# EasyEDA Pro project QuadPower.eprj

# Schematic Schematic1
Board Name: Board1; Create Date: 2025-01-30; Page Name: P1; Project Name: QuadPower; Schematic Name: Schematic1; Update Date: 2025-02-10; Company: SWimplify.co; Page Size: A4; Version: V1.0
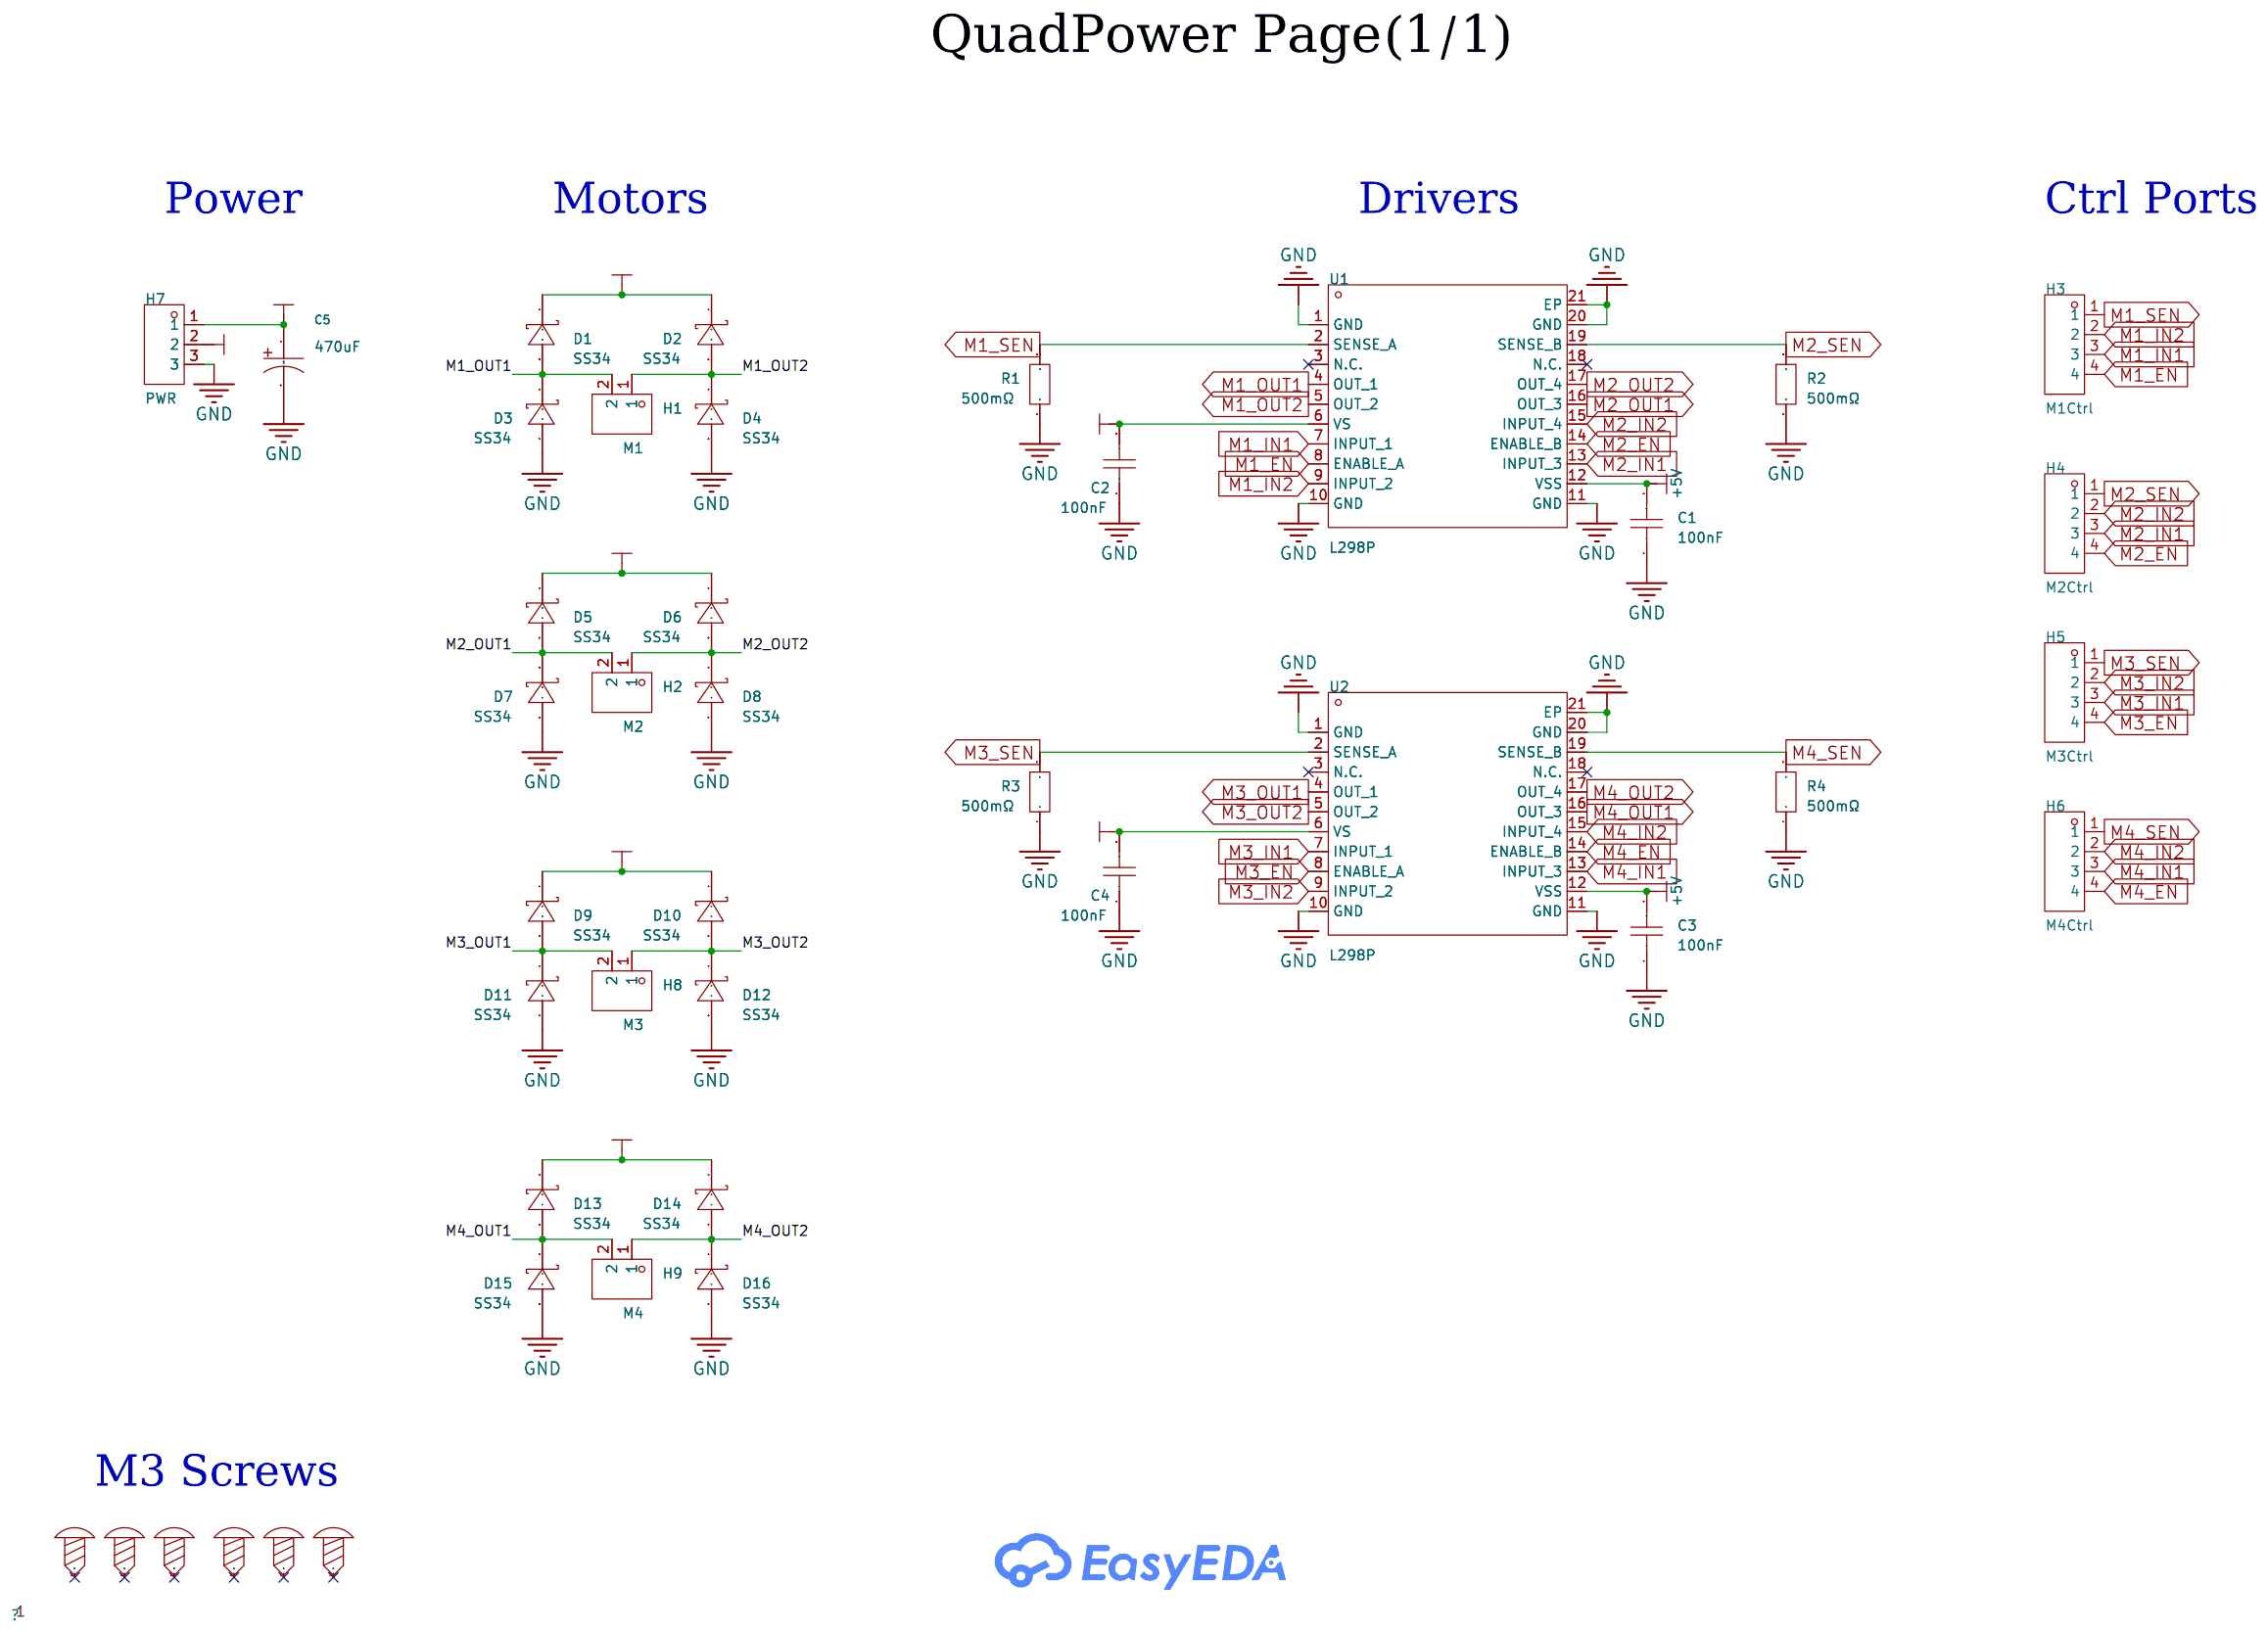
[diagram p0: schematic sheet]

## Parts
C1  100nF  [C0603]
C2  100nF  [C0603]
C3  100nF  [C0603]
C4  100nF  [C0603]
C5  470uF  [CAP-SMD_BD12.5-L13.0-W13.0-LS14.0-FD]
D1  SS34  [SMA_L4.3-W2.6-LS5.2-RD]
D2  SS34  [SMA_L4.3-W2.6-LS5.2-RD]
D3  SS34  [SMA_L4.3-W2.6-LS5.2-RD]
D4  SS34  [SMA_L4.3-W2.6-LS5.2-RD]
D5  SS34  [SMA_L4.3-W2.6-LS5.2-RD]
D6  SS34  [SMA_L4.3-W2.6-LS5.2-RD]
D7  SS34  [SMA_L4.3-W2.6-LS5.2-RD]
D8  SS34  [SMA_L4.3-W2.6-LS5.2-RD]
D9  SS34  [SMA_L4.3-W2.6-LS5.2-RD]
D10  SS34  [SMA_L4.3-W2.6-LS5.2-RD]
D11  SS34  [SMA_L4.3-W2.6-LS5.2-RD]
D12  SS34  [SMA_L4.3-W2.6-LS5.2-RD]
D13  SS34  [SMA_L4.3-W2.6-LS5.2-RD]
D14  SS34  [SMA_L4.3-W2.6-LS5.2-RD]
D15  SS34  [SMA_L4.3-W2.6-LS5.2-RD]
D16  SS34  [SMA_L4.3-W2.6-LS5.2-RD]
H1  M1  [CONN-TH_2P-P3.81_L7.4-W7.6]
H2  M2  [CONN-TH_2P-P3.81_L7.4-W7.6]
H3  M1Ctrl  [CONN-TH_DB125-2.54-4P-GN]
H4  M2Ctrl  [CONN-TH_DB125-2.54-4P-GN]
H5  M3Ctrl  [CONN-TH_DB125-2.54-4P-GN]
H6  M4Ctrl  [CONN-TH_DB125-2.54-4P-GN]
H7  PWR  [CONN-TH_3P-P3.81_L7.4-W11.4]
H8  M3  [CONN-TH_2P-P3.81_L7.4-W7.6]
H9  M4  [CONN-TH_2P-P3.81_L7.4-W7.6]
R1  500mΩ  [R1206]
R2  500mΩ  [R1206]
R3  500mΩ  [R1206]
R4  500mΩ  [R1206]
SCREW1  -  [Screw-Hole-M3]
SCREW2  -  [Screw-Hole-M3]
SCREW3  -  [Screw-Hole-M3]
SCREW4  -  [Screw-Hole-M3]
SCREW5  -  [Screw-Hole-M3]
SCREW6  -  [Screw-Hole-M3]
U1  L298P  [POWERSO20_L15.9-W11.0-P1.27-LS14.2-BL-EP]
U2  L298P  [POWERSO20_L15.9-W11.0-P1.27-LS14.2-BL-EP]

## Library data of the parts
C1-C4 = CGA0603X7R104K500JT: LCSC Part Name: 100nF ±10% 50V; Supplier Part: C6119867; Manufacturer: HRE(芯声); Supplier Footprint: 0603; JLCPCB Part Class: Extended Part; Supplier: LCSC; Tolerance: ±10%; Voltage Rated: 50V
C5 = RVT470UF50V34RV0133: Capacitance: Tolerance:±20% Tolerance:±20% Rated Voltage: Ripple Current:50mA@120Hz Equivalent Series Resistance(ESR):- φD: L: Lifetime @ Temp:2000hrs@105℃ Operating Temperature:-55℃~+105℃ Operating Temperature:-55℃~+105℃; LCSC Part Name: 470uF ±20% 50V; Supplier Part: C2837182; Manufacturer: KNSCHA(科尼盛); Supplier Footprint: SMD,D12.5xL13.5mm; JLCPCB Part Class: Extended Part; Datasheet: https://atta.szlcsc.com/upload/public/pdf/source/20210603/C2837182_E1DEB959C7A33C0F917E27B2DE8CCF98.pdf; Supplier: LCSC; Tolerance: ±20%; Ripple Current: 50mA@120Hz; Lifetime @ Temp: 2000hrs@105℃; Operating Temperature: -55℃~+105℃
D1-D16 = SS34_C8678: LCSC Part Name: 电压:40V 电流:3A; Supplier Part: C8678; Manufacturer: MDD(辰达半导体); Supplier Footprint: SMA(DO-214AC); JLCPCB Part Class: Basic Part; Datasheet: https://atta.szlcsc.com/upload/public/pdf/source/20240710/2118BB86FDDB2E0B294389AC1F3F65C8.pdf; Supplier: LCSC; Diode Configuration: Independent Type; Forward Voltage (Vf@If): 550mV@3A; Reverse Voltage (Vr): 40V; Rectified Current: 3A; Reverse Leakage Current (Ir): 500uA@40V
H1 H2 H8 H9 = DB125-3.81-2P-GN-S: LCSC Part Name: 3.81mm 1x2P 排数:1 每排P数:2 直插; Supplier Part: C395878; Manufacturer: DORABO(地博电气); Supplier Footprint: 插件,P=3.81mm; JLCPCB Part Class: Extended Part; Datasheet: https://atta.szlcsc.com/upload/public/pdf/source/20220823/CB89165D0F406880B925A92BEEA3FB50.pdf; Supplier: LCSC; Structure: 1x2P; Pitch: 3.81mm; Color: Green; Mounting Style: Straight; Current Rating (Max): 10A; Voltage Rating (Max): 300V; Number of Pins: 2P; Number of Rows: 1; Wire Gauge - AWG: 16~26; Wire Gauge - mm2: 0.5~1; Number of PINs Per Row: 2; Operating Temperature Range: -40℃~+105℃
H3-H6 = DB125-2.54-4P-GN-S: LCSC Part Name: 2.54mm 1x4P 排数:1 每排P数:4 直插; Supplier Part: C918122; Manufacturer: DORABO(地博电气); Supplier Footprint: 插件,P=2.54mm; JLCPCB Part Class: Extended Part; Datasheet: https://atta.szlcsc.com/upload/public/pdf/source/20230106/BCD3A0BE1EB95DC3E813F1745F022035.pdf; Supplier: LCSC; Structure: 1x4P; Pitch: 2.54mm; Color: Green; Mounting Style: Straight; Current Rating (Max): 8A; Voltage Rating (Max): 130V; Number of Pins: 4P; Number of Rows: 1; Wire Gauge - AWG: 18~26; Wire Gauge - mm2: 0.5~1; Number of PINs Per Row: 4; Operating Temperature Range: -40℃~+105℃
H7 = DB125-3.81-3P-GN-S: LCSC Part Name: 3.81mm 1x3P 排数:1 每排P数:3 直插; Supplier Part: C395879; Manufacturer: DORABO(地博电气); Supplier Footprint: 插件,P=3.81mm; JLCPCB Part Class: Extended Part; Datasheet: https://atta.szlcsc.com/upload/public/pdf/source/20220823/CB89165D0F406880B925A92BEEA3FB50.pdf; Supplier: LCSC; Structure: 1x3P; Pitch: 3.81mm; Color: Green; Mounting Style: Straight; Current Rating (Max): 10A; Voltage Rating (Max): 300V; Number of Pins: 3P; Number of Rows: 1; Wire Gauge - AWG: 16~26; Wire Gauge - mm2: 0.5~1; Number of PINs Per Row: 3; Operating Temperature Range: -40℃~+105℃
R1-R4 = HoYH1206-1W-500mR-1%: LCSC Part Name: 500mΩ ±1% 1W; Supplier Part: C601092; Manufacturer: Milliohm(毫欧); Supplier Footprint: 1206; JLCPCB Part Class: Extended Part; Datasheet: https://atta.szlcsc.com/upload/public/pdf/source/20200610/C601092_B551186B1E4AC109114EB92CE1D3D28D.pdf; Supplier: LCSC; Type: Current Sensing Resistors; Tolerance: ±1%; Temperature Coefficient: ±100ppm/℃; Mounting Sytle: Patch
SCREW1-SCREW6 = Screw-Hole-M3: Supplier Footprint: 插件; Check: false
U1 U2 = L298P: LCSC Part Name: 7V电机驱动芯片; Supplier Part: C85595; Manufacturer: ST(意法半导体); Supplier Footprint: PowerSO-20; JLCPCB Part Class: Extended Part; Datasheet: https://atta.szlcsc.com/upload/public/pdf/source/20181012/C111210_C12A10AEDADDE80938E7DEEDD1F73B12.pdf; Supplier: LCSC

## Nets
+5V: C1.2 C3.2 H7.2 U1.12(VSS) U2.12(VSS)
GND: C1.1 C2.1 C3.1 C4.1 C5.2 D3.2(A) D4.2(A) D7.2(A) D8.2(A) D11.2(A) D12.2(A) D15.2(A) D16.2(A) H7.3 R1.1 R2.1 R3.1 R4.1 U1.1(GND) U1.10(GND) U1.11(GND) U1.20(GND) U1.21(EP) U2.1(GND) U2.10(GND) U2.11(GND) U2.20(GND) U2.21(EP)
M1_EN: H3.4 U1.8(ENABLE A)
M1_IN1: H3.3 U1.7(INPUT 1)
M1_IN2: H3.2 U1.9(INPUT 2)
M1_OUT1: D1.2(A) D3.1(K) H1.2 U1.4(OUT 1)
M1_OUT2: D2.2(A) D4.1(K) H1.1 U1.5(OUT 2)
M1_SEN: H3.1 R1.2 U1.2(SENSE A)
M2_EN: H4.4 U1.14(ENABLE B)
M2_IN1: H4.3 U1.13(INPUT 3)
M2_IN2: H4.2 U1.15(INPUT 4)
M2_OUT1: D5.2(A) D7.1(K) H2.2 U1.16(OUT 3)
M2_OUT2: D6.2(A) D8.1(K) H2.1 U1.17(OUT 4)
M2_SEN: H4.1 R2.2 U1.19(SENSE B)
M3_EN: H5.4 U2.8(ENABLE A)
M3_IN1: H5.3 U2.7(INPUT 1)
M3_IN2: H5.2 U2.9(INPUT 2)
M3_OUT1: D9.2(A) D11.1(K) H8.2 U2.4(OUT 1)
M3_OUT2: D10.2(A) D12.1(K) H8.1 U2.5(OUT 2)
M3_SEN: H5.1 R3.2 U2.2(SENSE A)
M4_EN: H6.4 U2.14(ENABLE B)
M4_IN1: H6.3 U2.13(INPUT 3)
M4_IN2: H6.2 U2.15(INPUT 4)
M4_OUT1: D13.2(A) D15.1(K) H9.2 U2.16(OUT 3)
M4_OUT2: D14.2(A) D16.1(K) H9.1 U2.17(OUT 4)
M4_SEN: H6.1 R4.2 U2.19(SENSE B)
VS: C2.2 C4.2 C5.1 D1.1(K) D2.1(K) D5.1(K) D6.1(K) D9.1(K) D10.1(K) D13.1(K) D14.1(K) H7.1 U1.6(VS) U2.6(VS)

Not connected (* = marked no-connect by the designer): SCREW1 1*; SCREW2 1*; SCREW3 1*; SCREW4 1*; SCREW5 1*; SCREW6 1*; U1 3(N.C.)* 18(N.C.)*; U2 3(N.C.)* 18(N.C.)*

## Notes on the sheet
- QuadPower Page(1/1)
- Power
- Motors
- Drivers
- Ctrl Ports
- M3 Screws

# Board PCB1
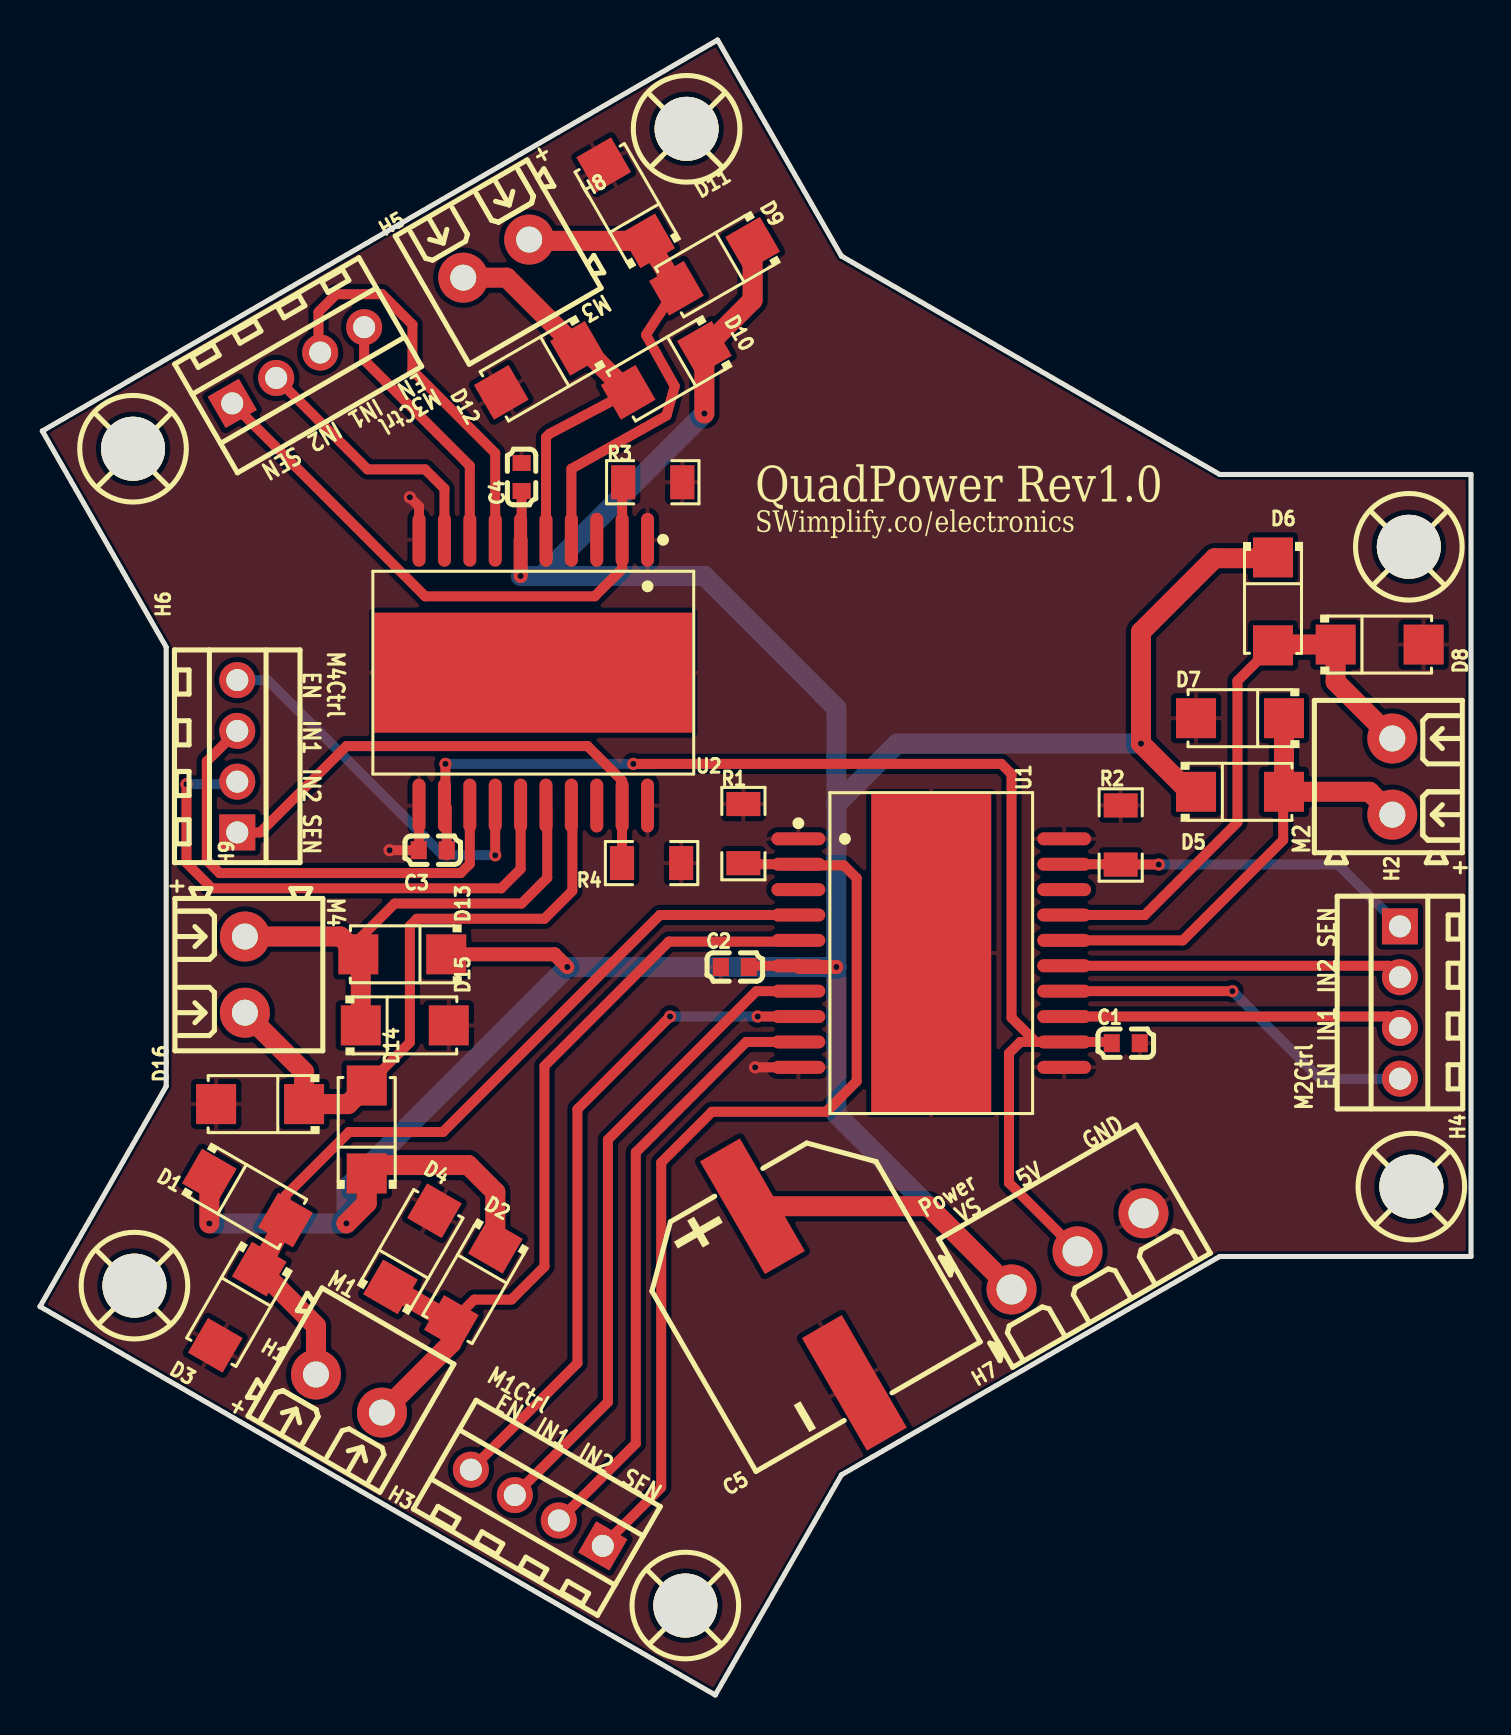
[diagram p1: board, top side]
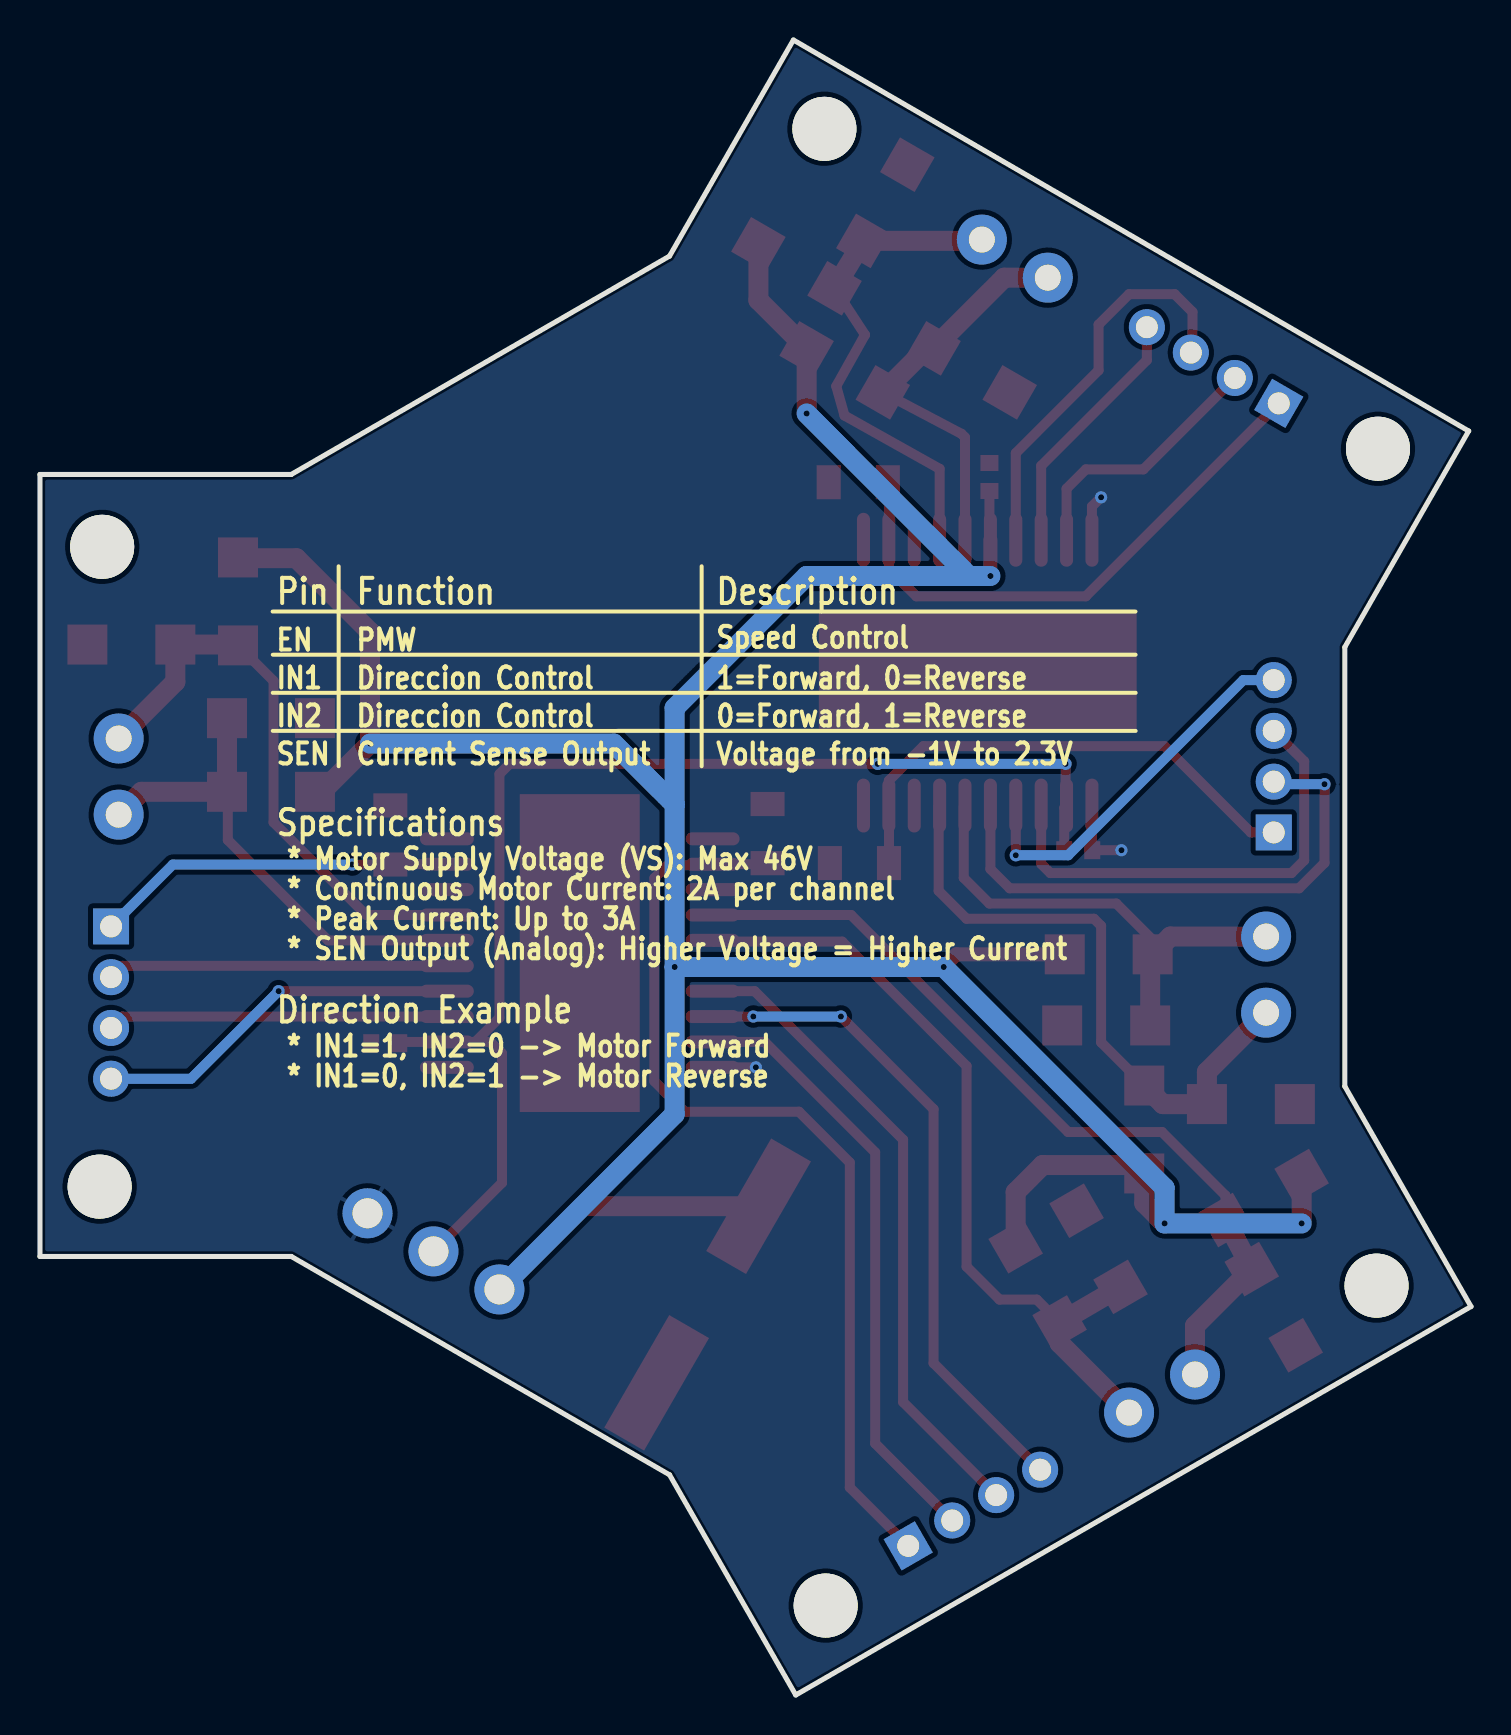
[diagram p2: board, bottom side, seen from below]

Outline 71.59 x 82.79 mm; copper layers: Top Layer, Bottom Layer. Coordinates in mm from the lower left corner of the outline.
Outline path: 0,19.43 6.31,30.45 6.31,52.42 0.12,63.23 33.9,82.79 40.1,71.98 59.02,61.05 71.59,61.05 71.59,21.94 59.02,21.94 40.1,11.02 33.78,0 0,19.43
Stack: Top Layer 0.035mm / Dielectric1 1.51mm FR4 er 4.5 / Bottom Layer 0.035mm

## Design rules (mm)
template: Custom Config
spacing copperThickness1oz (default): track to track 0.102, other pairs 0.152 to 0.3
spacing copperThickness2oz: track to track 0.203, other pairs 0.152 to 0.3
track width copperThickness1oz (default): min 0.127, default 0.254, max 2.54
track width copperThickness2oz: min 0.203, default 0.254, max 2.54
differential pair differentialPair (default): width min 0.127, default 0.254, max 2.54; gap min 0.152, default 0.152
via viaSize (default): diameter min 0.5, default 0.61, max 10; hole min 0.3, default 0.305, max 6.3
net GND uses copperRegion2

## Placement (name value [footprint] x y rotation side)
C1  100nF  [C0603]  54.32 32.61 180 top
C2  100nF  [C0603]  34.76 36.42 0 top
C3  100nF  [C0603]  19.65 42.26 0 top
C4  100nF  [C0603]  24.09 60.93 270 top
C5  470uF  [CAP-SMD_BD12.5-L13.0-W13.0-LS14.0-FD]  38.19 20.03 300 top
D1  SS34  [SMA_L4.3-W2.6-LS5.2-RD]  10.38 24.86 330 top
D2  SS34  [SMA_L4.3-W2.6-LS5.2-RD]  21.68 20.54 240 top
D3  SS34  [SMA_L4.3-W2.6-LS5.2-RD]  9.87 19.4 240 top
D4  SS34  [SMA_L4.3-W2.6-LS5.2-RD]  18.63 22.32 60 top
D5  SS34  [SMA_L4.3-W2.6-LS5.2-RD]  60.04 45.18 0 top
D6  SS34  [SMA_L4.3-W2.6-LS5.2-RD]  61.69 54.7 270 top
D7  SS34  [SMA_L4.3-W2.6-LS5.2-RD]  60.04 48.86 180 top
D8  SS34  [SMA_L4.3-W2.6-LS5.2-RD]  67.02 52.55 0 top
D9  SS34  [SMA_L4.3-W2.6-LS5.2-RD]  33.75 71.47 210 top
D10  SS34  [SMA_L4.3-W2.6-LS5.2-RD]  31.33 66.26 210 top
D11  SS34  [SMA_L4.3-W2.6-LS5.2-RD]  29.3 74.64 120 top
D12  SS34  [SMA_L4.3-W2.6-LS5.2-RD]  24.98 66.26 210 top
D13  SS34  [SMA_L4.3-W2.6-LS5.2-RD]  18.13 37.05 180 top
D14  SS34  [SMA_L4.3-W2.6-LS5.2-RD]  16.35 28.29 90 top
D15  SS34  [SMA_L4.3-W2.6-LS5.2-RD]  18.25 33.5 0 top
D16  SS34  [SMA_L4.3-W2.6-LS5.2-RD]  11.01 29.56 180 top
H1  M1  [CONN-TH_2P-P3.81_L7.4-W7.6]  15.46 15.08 150 top
H2  M2  [CONN-TH_2P-P3.81_L7.4-W7.6]  67.66 45.94 270 top
H3  M1Ctrl  [CONN-TH_DB125-2.54-4P-GN]  24.86 9.37 150 top
H4  M2Ctrl  [CONN-TH_DB125-2.54-4P-GN]  68.04 34.64 270 top
H5  M3Ctrl  [CONN-TH_DB125-2.54-4P-GN]  12.92 66.52 30 top
H6  M4Ctrl  [CONN-TH_DB125-2.54-4P-GN]  9.87 46.96 90 top
H7  PWR  [CONN-TH_3P-P3.81_L7.4-W11.4]  51.91 22.19 30 top
H8  M3  [CONN-TH_2P-P3.81_L7.4-W7.6]  22.82 71.85 30 top
H9  M4  [CONN-TH_2P-P3.81_L7.4-W7.6]  10.25 36.03 90 top
NOREF  -  [Screw-Hole-M3]  68.67 25.37 0 top
NOREF#2  -  [Screw-Hole-M3]  32.35 4.41 0 top
NOREF#3  -  [Screw-Hole-M3]  4.79 20.41 0 top
NOREF#4  -  [Screw-Hole-M3]  68.54 57.37 0 top
NOREF#5  -  [Screw-Hole-M3]  32.41 78.28 0 top
NOREF#6  -  [Screw-Hole-M3]  4.72 62.28 0 top
R1  500mΩ  [R1206]  35.19 43.09 270 top
R2  500mΩ  [R1206]  54.07 43.02 270 top
R3  500mΩ  [R1206]  30.66 60.66 180 top
R4  500mΩ  [R1206]  30.6 41.61 180 top
U1  L298P  [POWERSO20_L15.9-W11.0-P1.27-LS14.2-BL-EP]  44.59 37.11 270 top
U2  L298P  [POWERSO20_L15.9-W11.0-P1.27-LS14.2-BL-EP]  24.68 51.14 180 top

## Footprints (pads in the part's own frame, mm; a bottom-side part is the same pattern mirrored in y, then rotated)
C0603
  rect 0.8x0.9 smd: 1(-0.7,0) 2(0.7,0)
CAP-SMD_BD12.5-L13.0-W13.0-LS14.0-FD
  rect 6.5x2.3 smd: 1(-5.1,0) 2(5.1,0)
CONN-TH_2P-P3.81_L7.4-W7.6
  round 2.5 hole 1.3: 1(-1.905,0) 2(1.905,0)
CONN-TH_3P-P3.81_L7.4-W11.4
  round 2.5 hole 1.5: 1(-3.81,0) 2(0,0) 3(3.81,0)
CONN-TH_DB125-2.54-4P-GN
  rect 1.8x1.8 hole 1.1: 1(-3.81,0)
  round 1.8 hole 1.1: 2(-1.27,0) 3(1.27,0) 4(3.81,0)
POWERSO20_L15.9-W11.0-P1.27-LS14.2-BL-EP
  oval 0.651x2.696 smd: 1(-5.715,-6.647) 2(-4.445,-6.647) 3(-3.175,-6.647) 4(-1.905,-6.647) 5(-0.635,-6.647) 6(0.635,-6.647) 7(1.905,-6.647) 8(3.175,-6.647) 9(4.445,-6.647) 10(5.715,-6.647) 11(5.715,6.647) 12(4.445,6.647) 13(3.175,6.647) 14(1.905,6.647) 15(0.635,6.647) 16(-0.635,6.647) 17(-1.905,6.647) 18(-3.175,6.647) 19(-4.445,6.647) 20(-5.715,6.647)
  rect 15.9x6 smd: 21(0,0)
R1206
  rect 1.208x1.701 smd: 1(-1.479,0) 2(1.479,0)
Screw-Hole-M3
  round 3.2 hole 3.2: 1(-0.064,0.064)
SMA_L4.3-W2.6-LS5.2-RD
  rect 2x2 smd: 1(-2.2,0) 2(2.2,0)

## Nets
As in the schematic.

Pads without a net: NOREF 1; NOREF#2 1; NOREF#3 1; NOREF#4 1; NOREF#5 1; NOREF#6 1; U1 3 18; U2 3 18

## Via types
v1: diameter 0.61, hole 0.305, Top Layer to Bottom Layer, 18 vias

## Routing (per net, layer and track width the routed paths; a pad name or vN(x,y) marks a point on that pad's centre or on a via; arc(x,y) is an arc through that point)
+5V: length 63.9
  Top Layer w0.5: 49.81,32.67 U1.12 53.69,32.67 53.75,32.61 ; 49.81,32.67 49.05,32.67 48.48,32.1 48.48,25.62 H7.2 ; 49.81,32.67 48.61,33.88 48.61,46.07 48.1,46.58 v1(29.68,46.58) ; 20.35,42 20.35,44.38 U2.12 20.28,44.54 v1(20.28,46.58)
  Bottom Layer w0.5: v1(29.68,46.58) v1(20.28,46.58)
GND: length 8.2
  Top Layer w0.5: U2.11 18.96,42.27 C3.1 v1(17.49,42.26) ; v1(18.51,59.91) 18.96,59.45 18.96,57.79 ; U1.10 v1(35.78,31.4)
M1_EN: length 33.2
  Top Layer w0.5: v1(35.91,33.94) 35.91,33.94 U1.8 ; v1(31.52,33.94) 26.89,29.3 26.89,16.6 H3.4
  Bottom Layer w0.5: v1(31.52,33.94) v1(35.91,33.94)
M1_IN1: length 32.3
  Top Layer w0.5: H3.3 28.41,14.66 28.41,27.78 35.84,35.21 U1.7
M1_IN2: length 30.4
  Top Layer w0.5: 25.96,8.73 29.81,12.58 29.81,27.15 35.33,32.67 U1.9
M1_OUT1: length 41.9
  Top Layer w0.5: U1.4 31.01,39.02 20.16,28.16 15.46,28.16 12.28,24.99 D1.2
  Top Layer w1: D1.2 D3.1 13.81,18.47 H1.2
M1_OUT2: length 40.6
  Top Layer w0.5: U1.5 37.88,37.69 31.46,37.69 25.24,31.46 25.24,21.43 23.59,19.78 21.72,19.78 D2.2
  Top Layer w1: 17.11,14.13 20.58,17.6 D2.2 D4.1
M1_SEN: length 48
  Top Layer w0.5: R1.2 35.24,41.56 U1.2 38,41.5 40.22,41.5 40.86,40.86 40.86,30.7 39.33,29.18 33.62,29.18 31.08,26.64 31.08,10.38 H3.1
M2_EN: length 18.6
  Top Layer w0.5: U1.14 v1(59.65,35.21)
  Bottom Layer w0.5: v1(59.65,35.21) 64.03,30.83 H4.4
M2_IN1: length 17
  Top Layer w0.5: U1.13 67.47,33.94 H4.3
M2_IN2: length 17
  Top Layer w0.5: U1.15 67.47,36.48 H4.2
M2_OUT1: length 25
  Top Layer w0.5: D5.2 62.19,45.14 62.19,42.77 57.18,37.75 U1.16
  Top Layer w1: D7.1 D5.2 66.51,45.18 H2.2
M2_OUT2: length 29.2
  Top Layer w0.5: U1.17 55.27,39.02 59.91,43.66 59.91,50.73 D6.2
  Top Layer w1: H2.1 64.82,50.68 D8.1 61.73,52.55 D6.2
M2_SEN: length 18.1
  Top Layer w0.5: U1.19 54.05,41.56 54.07,41.54 v1(55.97,41.54)
  Bottom Layer w0.5: H4.1 64.94,41.54 v1(55.97,41.54)
M3_EN: length 12.8
  Top Layer w0.5: H5.4 16.22,66.77 21.5,61.48 21.5,57.79
M3_IN1: length 20.2
  Top Layer w0.5: 22.77,57.79 22.77,62.12 18.63,66.26 18.63,68.55 17.11,70.07 14.82,70.07 13.93,69.18 13.93,67.23 H5.3
M3_IN2: length 13.3
  Top Layer w0.5: 11.82,65.88 16.39,61.31 19.27,61.31 20.23,60.34 20.23,57.79
M3_OUT1: length 25
  Top Layer w0.5: D9.2 30.32,68.04 31.76,65.47 31.34,64 26.58,61.34 26.58,57.79
  Top Layer w1: D9.2 D11.1 24.54,72.74 H8.2
M3_OUT2: length 20.5
  Top Layer w0.5: 29.43,65.16 25.49,63.09 25.31,62.91 25.31,57.79
  Top Layer w1: 21.17,70.9 23.35,70.9 D12.1 27.23,67.36 29.43,65.16
M3_SEN: length 28.4
  Top Layer w0.5: H5.1 19.27,54.96 27.75,54.96 29.12,56.33 29.12,60.61 R3.2
M4_EN: length 19
  Top Layer w0.5: U2.14 v1(22.77,42)
  Bottom Layer w0.5: H6.4 11.39,50.77 20.16,42 v1(22.77,42)
M4_IN1: length 23.6
  Top Layer w0.5: H6.3 8.35,46.7 8.35,41.75 8.98,41.12 21.05,41.12 21.5,41.57 U2.13
M4_IN2: length 27.3
  Top Layer w0.5: v1(7.33,45.56) 7.33,41.62 8.6,40.35 23.08,40.35 24.04,41.32 U2.15
  Bottom Layer w0.5: v1(7.33,45.56) 9.74,45.56 H6.2
M4_OUT1: length 24.8
  Top Layer w0.5: D13.2 15.92,37.77 17.74,39.59 24.09,39.59 25.38,40.87 25.38,44.43 U2.16
  Top Layer w1: H9.2 15.04,37.94 D13.2 16.05,36.92 16.05,33.5
M4_OUT2: length 31.3
  Top Layer w0.5: D14.2 18.51,32.65 18.51,38.48 18.86,38.83 25.24,38.83 26.63,40.23 26.63,44.44 U2.17
  Top Layer w1: D14.2 15.42,29.56 D16.1 13.21,31.17 H9.1
M4_SEN: length 25.9
  Top Layer w0.5: H6.1 11.01,43.15 15.33,47.47 27.4,47.47 29.12,45.74 U2.19 29.12,44.48 R4.2
VS: length 188.8
  Top Layer w0.5: C2.2 35.52,36.48 U1.6 ; 24.04,57.79 24.09,57.84 C4.2
  Top Layer w0.7: D13.1 25.74,37.05 v1(26.38,36.42) ; 24.04,57.79 v1(24.04,55.97) ; U1.6 38,36.42 v1(39.84,36.42)
  Top Layer w1: C5.1 44.45,24.45 H7.1 ; D6.1 61.64,56.86 58.77,56.86 55.08,53.18 v1(55.08,47.59) 57.49,45.18 D5.1 ; D9.1 35.65,69.77 33.24,67.36 v1(33.24,64.1) ; D2.1 22.78,25.16 21.43,26.51 16.77,26.51 D14.1 16.35,24.61 v1(15.33,23.59) ; v1(8.47,23.59) D1.1
  Bottom Layer w1: v1(39.84,36.42) 39.84,44.54 ; v1(39.84,36.42) v1(26.38,36.42) 15.33,25.37 v1(15.33,23.59) v1(8.47,23.59) ; v1(39.84,36.42) 39.84,29.05 H7.1 ; 39.84,44.54 39.84,49.37 33.24,55.97 25.11,55.97 ; 39.84,44.54 42.89,47.59 v1(55.08,47.59) ; 25.11,55.97 v1(33.24,64.1) ; 25.11,55.97 v1(24.04,55.97)

## Copper pours and planes (outline as drawn; the poured copper is in the pictures)
GND on Top Layer: -0.67,18.38 33.75,-1.43 40.86,10.38 59.27,20.8 72.23,19.78 72.35,62.07 59.65,61.69 40.86,72.74 34,83.79 -0.92,63.59 5.55,52.16 5.81,30.95 -0.67,18.89
GND on Bottom Layer: 34,-0.92 40.6,10.63 59.27,21.18 71.97,21.3 72.35,61.56 59.27,61.69 40.35,72.48 34,83.66 -0.92,63.72 5.55,52.42 5.68,30.83 -0.8,19.4

## Text on the board
Bottom Silkscreen Layer: Speed Control | 1=Forward, 0=Reverse | 0=Forward, 1=Reverse | Voltage from -1V to 2.3V | PMW | Direccion Control | Current Sense Output | * Motor Supply Voltage (VS): Max 46V | * Continuous Motor Current: 2A per channel | * Peak Current: Up to 3A | * SEN Output (Analog): Higher Voltage = Higher Current | * IN1=1, IN2=0 -> Motor Forward | * IN1=0, IN2=1 -> Motor Reverse | EN | IN1 | IN2 | SEN | Description | Function | Pin | Specifications | Direction Example
Top Silkscreen Layer: Power | VS | 5V | GND | M2 | M2Ctrl | SEN | IN2 | IN1 | EN | + | M3Ctrl | M3 | M4Ctrl | M4 | M1 | M1Ctrl | SWimplify.co/electronics | QuadPower Rev1.0
